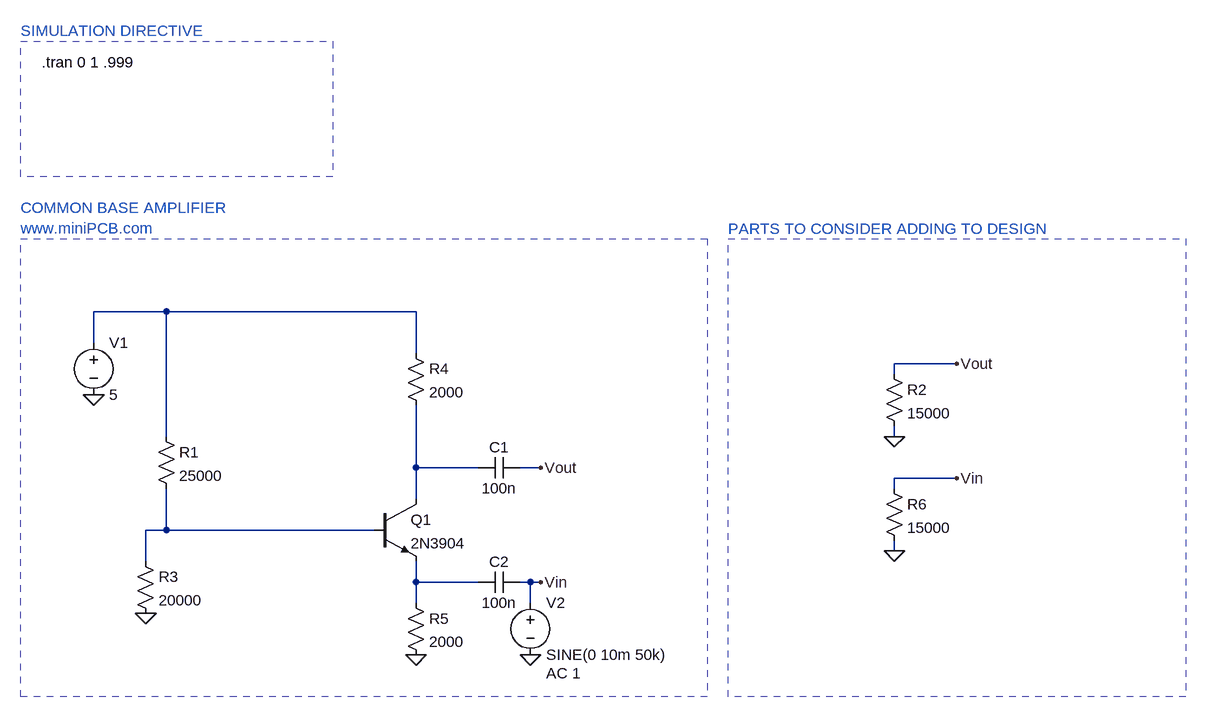
[diagram p0: schematic 04B-060.asc]
04B-060.asc, the LTspice schematic file:
Version 4.1
SHEET 1 1412 680
WIRE -160 -144 -272 -144
WIRE 224 -144 -160 -144
WIRE -272 -96 -272 -144
WIRE 224 -80 224 -144
WIRE 1056 -64 960 -64
WIRE 960 -48 960 -64
WIRE -160 48 -160 -144
WIRE 960 48 960 32
WIRE 224 96 224 0
WIRE 320 96 224 96
WIRE 416 96 384 96
WIRE 1056 112 960 112
WIRE 960 128 960 112
WIRE 224 144 224 96
WIRE -160 192 -160 128
WIRE -160 192 -192 192
WIRE 160 192 -160 192
WIRE 960 224 960 208
WIRE -192 240 -192 192
WIRE 224 272 224 240
WIRE 320 272 224 272
WIRE 400 272 384 272
WIRE 416 272 400 272
WIRE 224 304 224 272
WIRE 400 304 400 272
FLAG -192 320 0
FLAG 224 384 0
FLAG -272 -16 0
FLAG 416 96 Vout
FLAG 416 272 Vin
FLAG 400 384 0
FLAG 960 224 0
FLAG 960 48 0
FLAG 1056 -64 Vout
FLAG 1056 112 Vin
SYMBOL npn 160 144 R0
SYMATTR InstName Q1
SYMATTR Value 2N3904
SYMBOL res 208 288 R0
SYMATTR InstName R5
SYMATTR Value 2000
SYMBOL res -176 32 R0
SYMATTR InstName R1
SYMATTR Value 25000
SYMBOL res -208 224 R0
SYMATTR InstName R3
SYMATTR Value 20000
SYMBOL res 208 -96 R0
SYMATTR InstName R4
SYMATTR Value 2000
SYMBOL voltage -272 -112 R0
WINDOW 123 0 0 Left 0
WINDOW 39 0 0 Left 0
SYMATTR InstName V1
SYMATTR Value 5
SYMBOL cap 384 80 R90
WINDOW 0 0 32 VBottom 2
WINDOW 3 32 32 VTop 2
SYMATTR InstName C1
SYMATTR Value 100n
SYMBOL cap 384 256 R90
WINDOW 0 0 32 VBottom 2
WINDOW 3 32 32 VTop 2
SYMATTR InstName C2
SYMATTR Value 100n
SYMBOL voltage 400 288 R0
WINDOW 123 24 124 Left 2
WINDOW 39 0 0 Left 0
SYMATTR Value2 AC 1
SYMATTR InstName V2
SYMATTR Value SINE(0 10m 50k)
SYMBOL res 944 -64 R0
SYMATTR InstName R2
SYMATTR Value 15000
SYMBOL res 944 112 R0
SYMATTR InstName R6
SYMATTR Value 15000
TEXT -352 -528 Left 2 !.tran 0 1 .999
TEXT -384 -304 Left 2 ;COMMON BASE AMPLIFIER\nwww.miniPCB.com
TEXT -384 -576 Left 2 ;SIMULATION DIRECTIVE
TEXT 704 -272 Left 2 ;PARTS TO CONSIDER ADDING TO DESIGN
RECTANGLE Normal 672 448 -384 -256 2
RECTANGLE Normal 96 -352 -384 -560 2
RECTANGLE Normal 1408 448 704 -256 2

The netlist it stands for:
* 04B-060.asc
Q1 N002 N003 N004 0 2N3904
R5 N004 0 2000
R1 N001 N003 25000
R3 N003 0 20000
R4 N001 N002 2000
V1 N001 0 5
C1 Vout N002 100n
C2 Vin N004 100n
V2 Vin 0 SINE(0 10m 50k) AC 1
R2 Vout 0 15000
R6 Vin 0 15000
.model NPN NPN
.model PNP PNP
.lib standard.bjt
.tran 0 1 .999
* COMMON BASE AMPLIFIER
* www.miniPCB.com
* SIMULATION DIRECTIVE
* PARTS TO CONSIDER ADDING TO DESIGN
.backanno
.end